# EAGLE design MicromouseV1.0.0 (EAGLE 9.4.2)
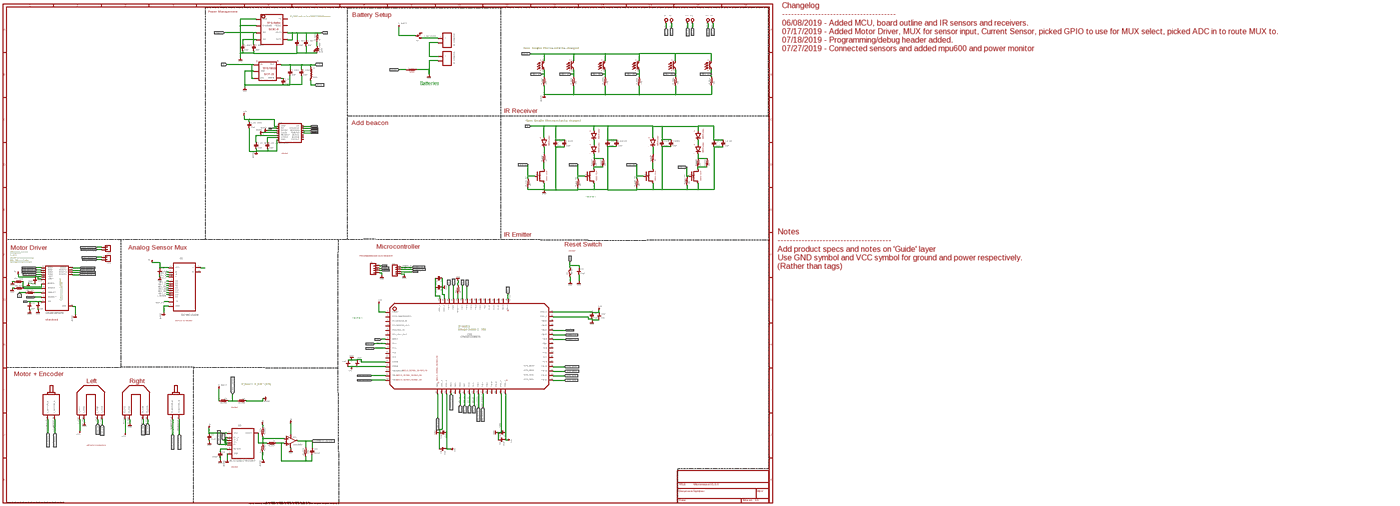
[diagram p0: schematic, sheet 1, overview]
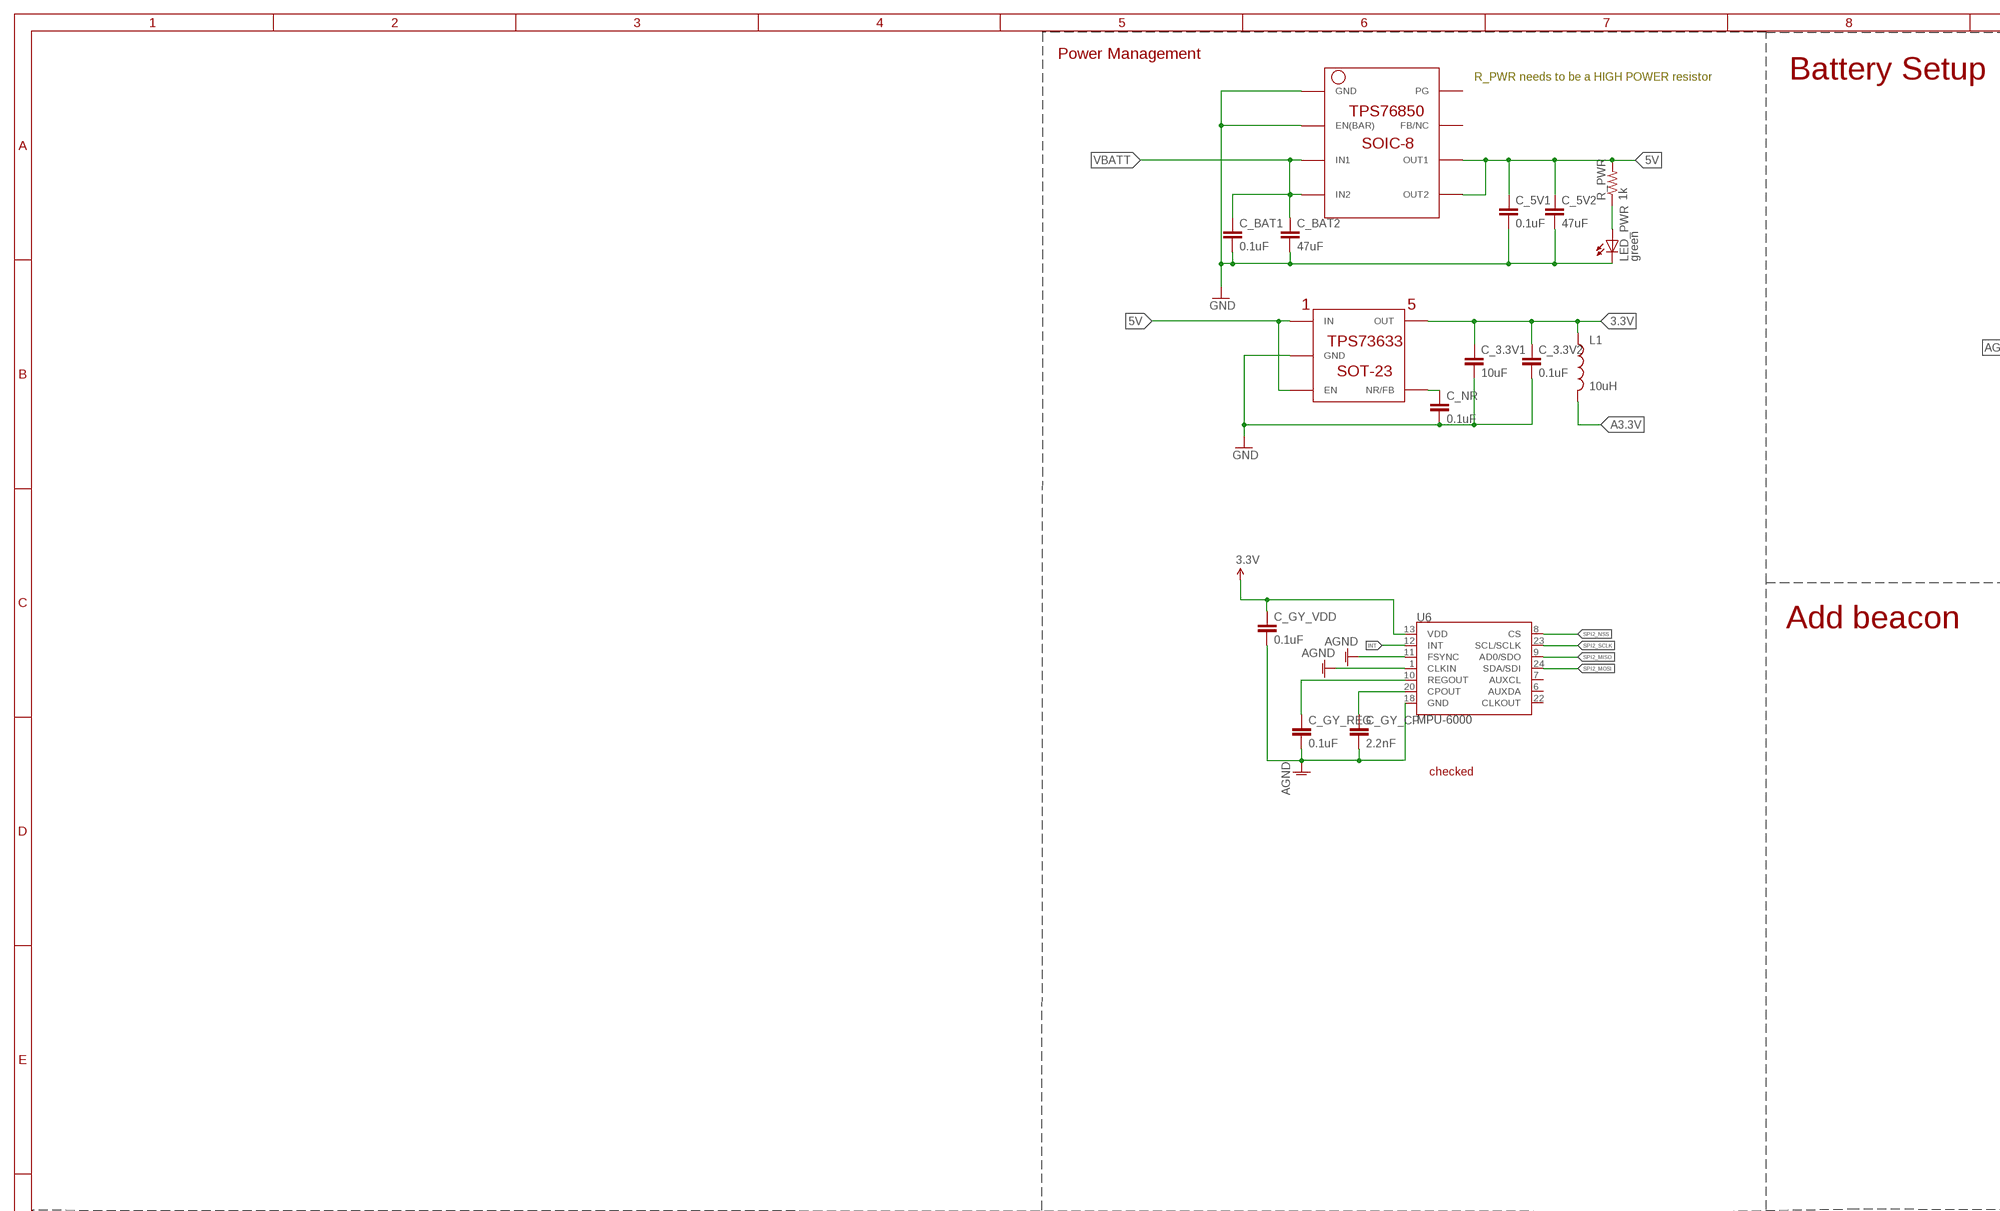
[diagram p1: schematic, sheet 1, part 1 of 6]
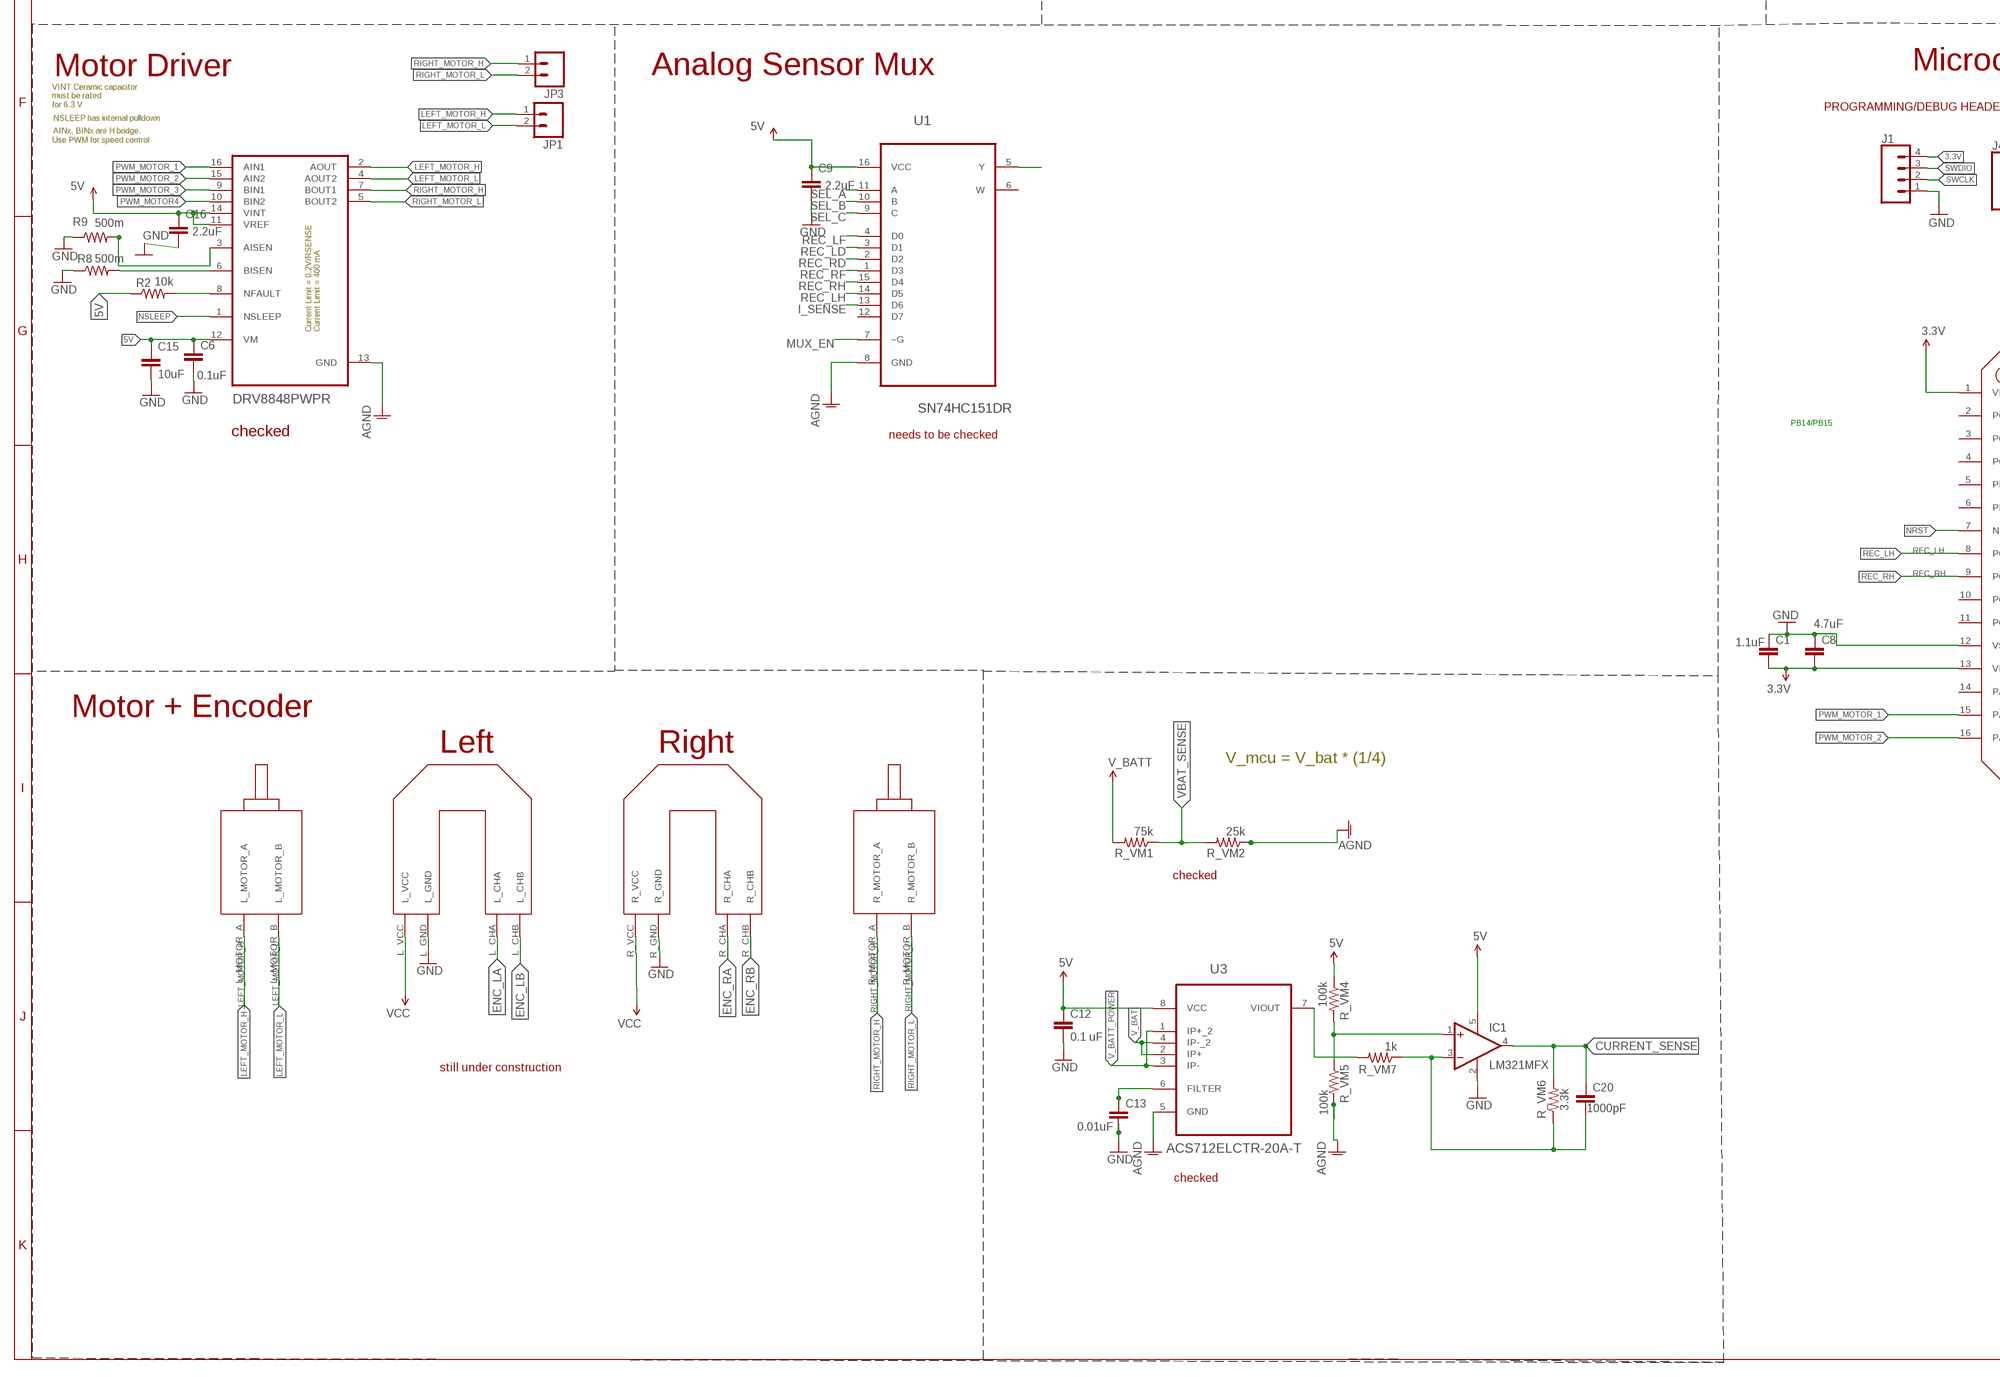
[diagram p2: schematic, sheet 1, part 2 of 6]
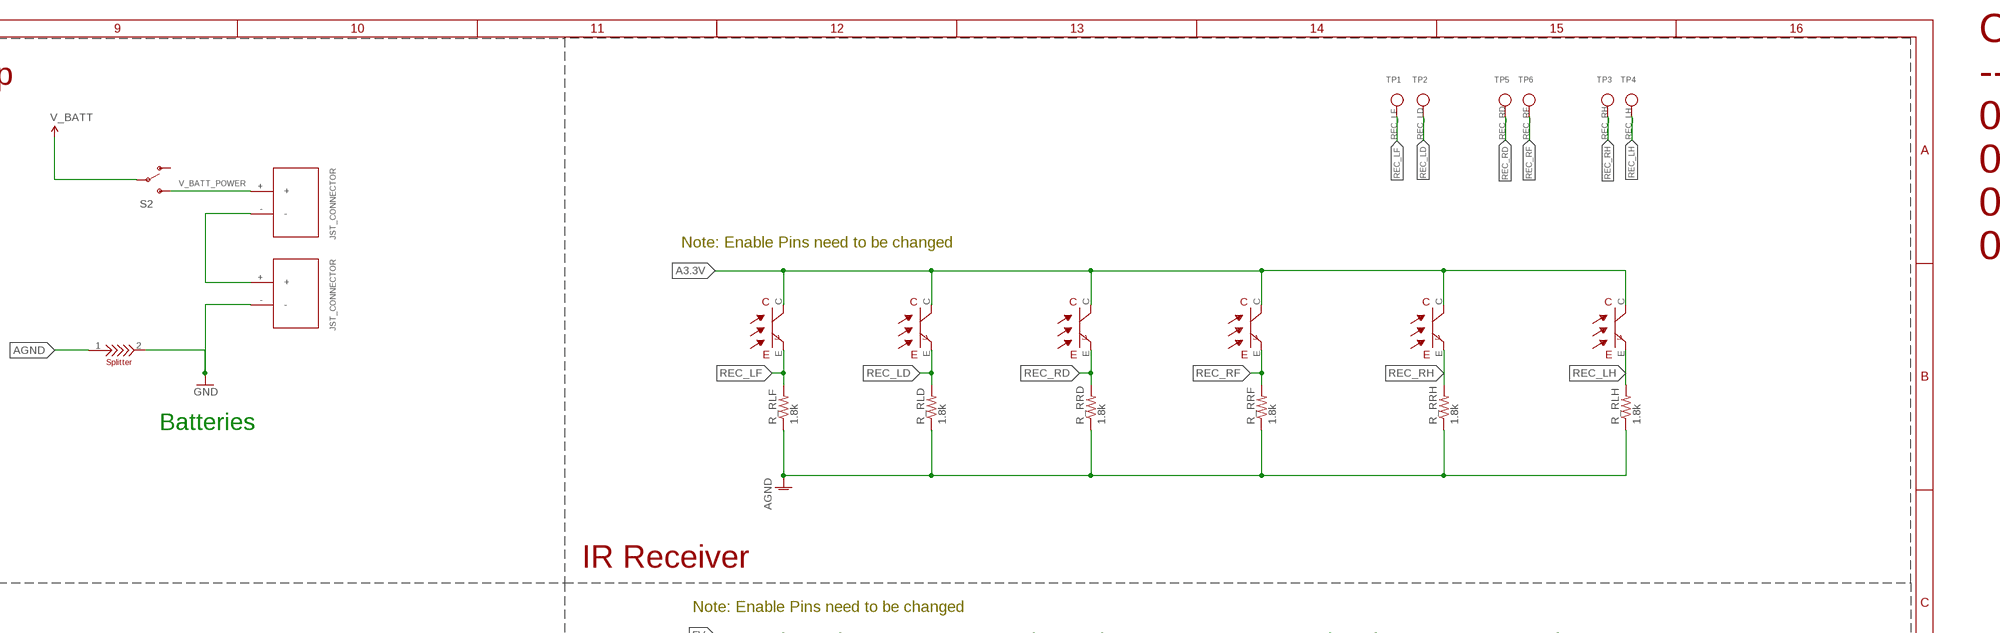
[diagram p3: schematic, sheet 1, part 3 of 6]
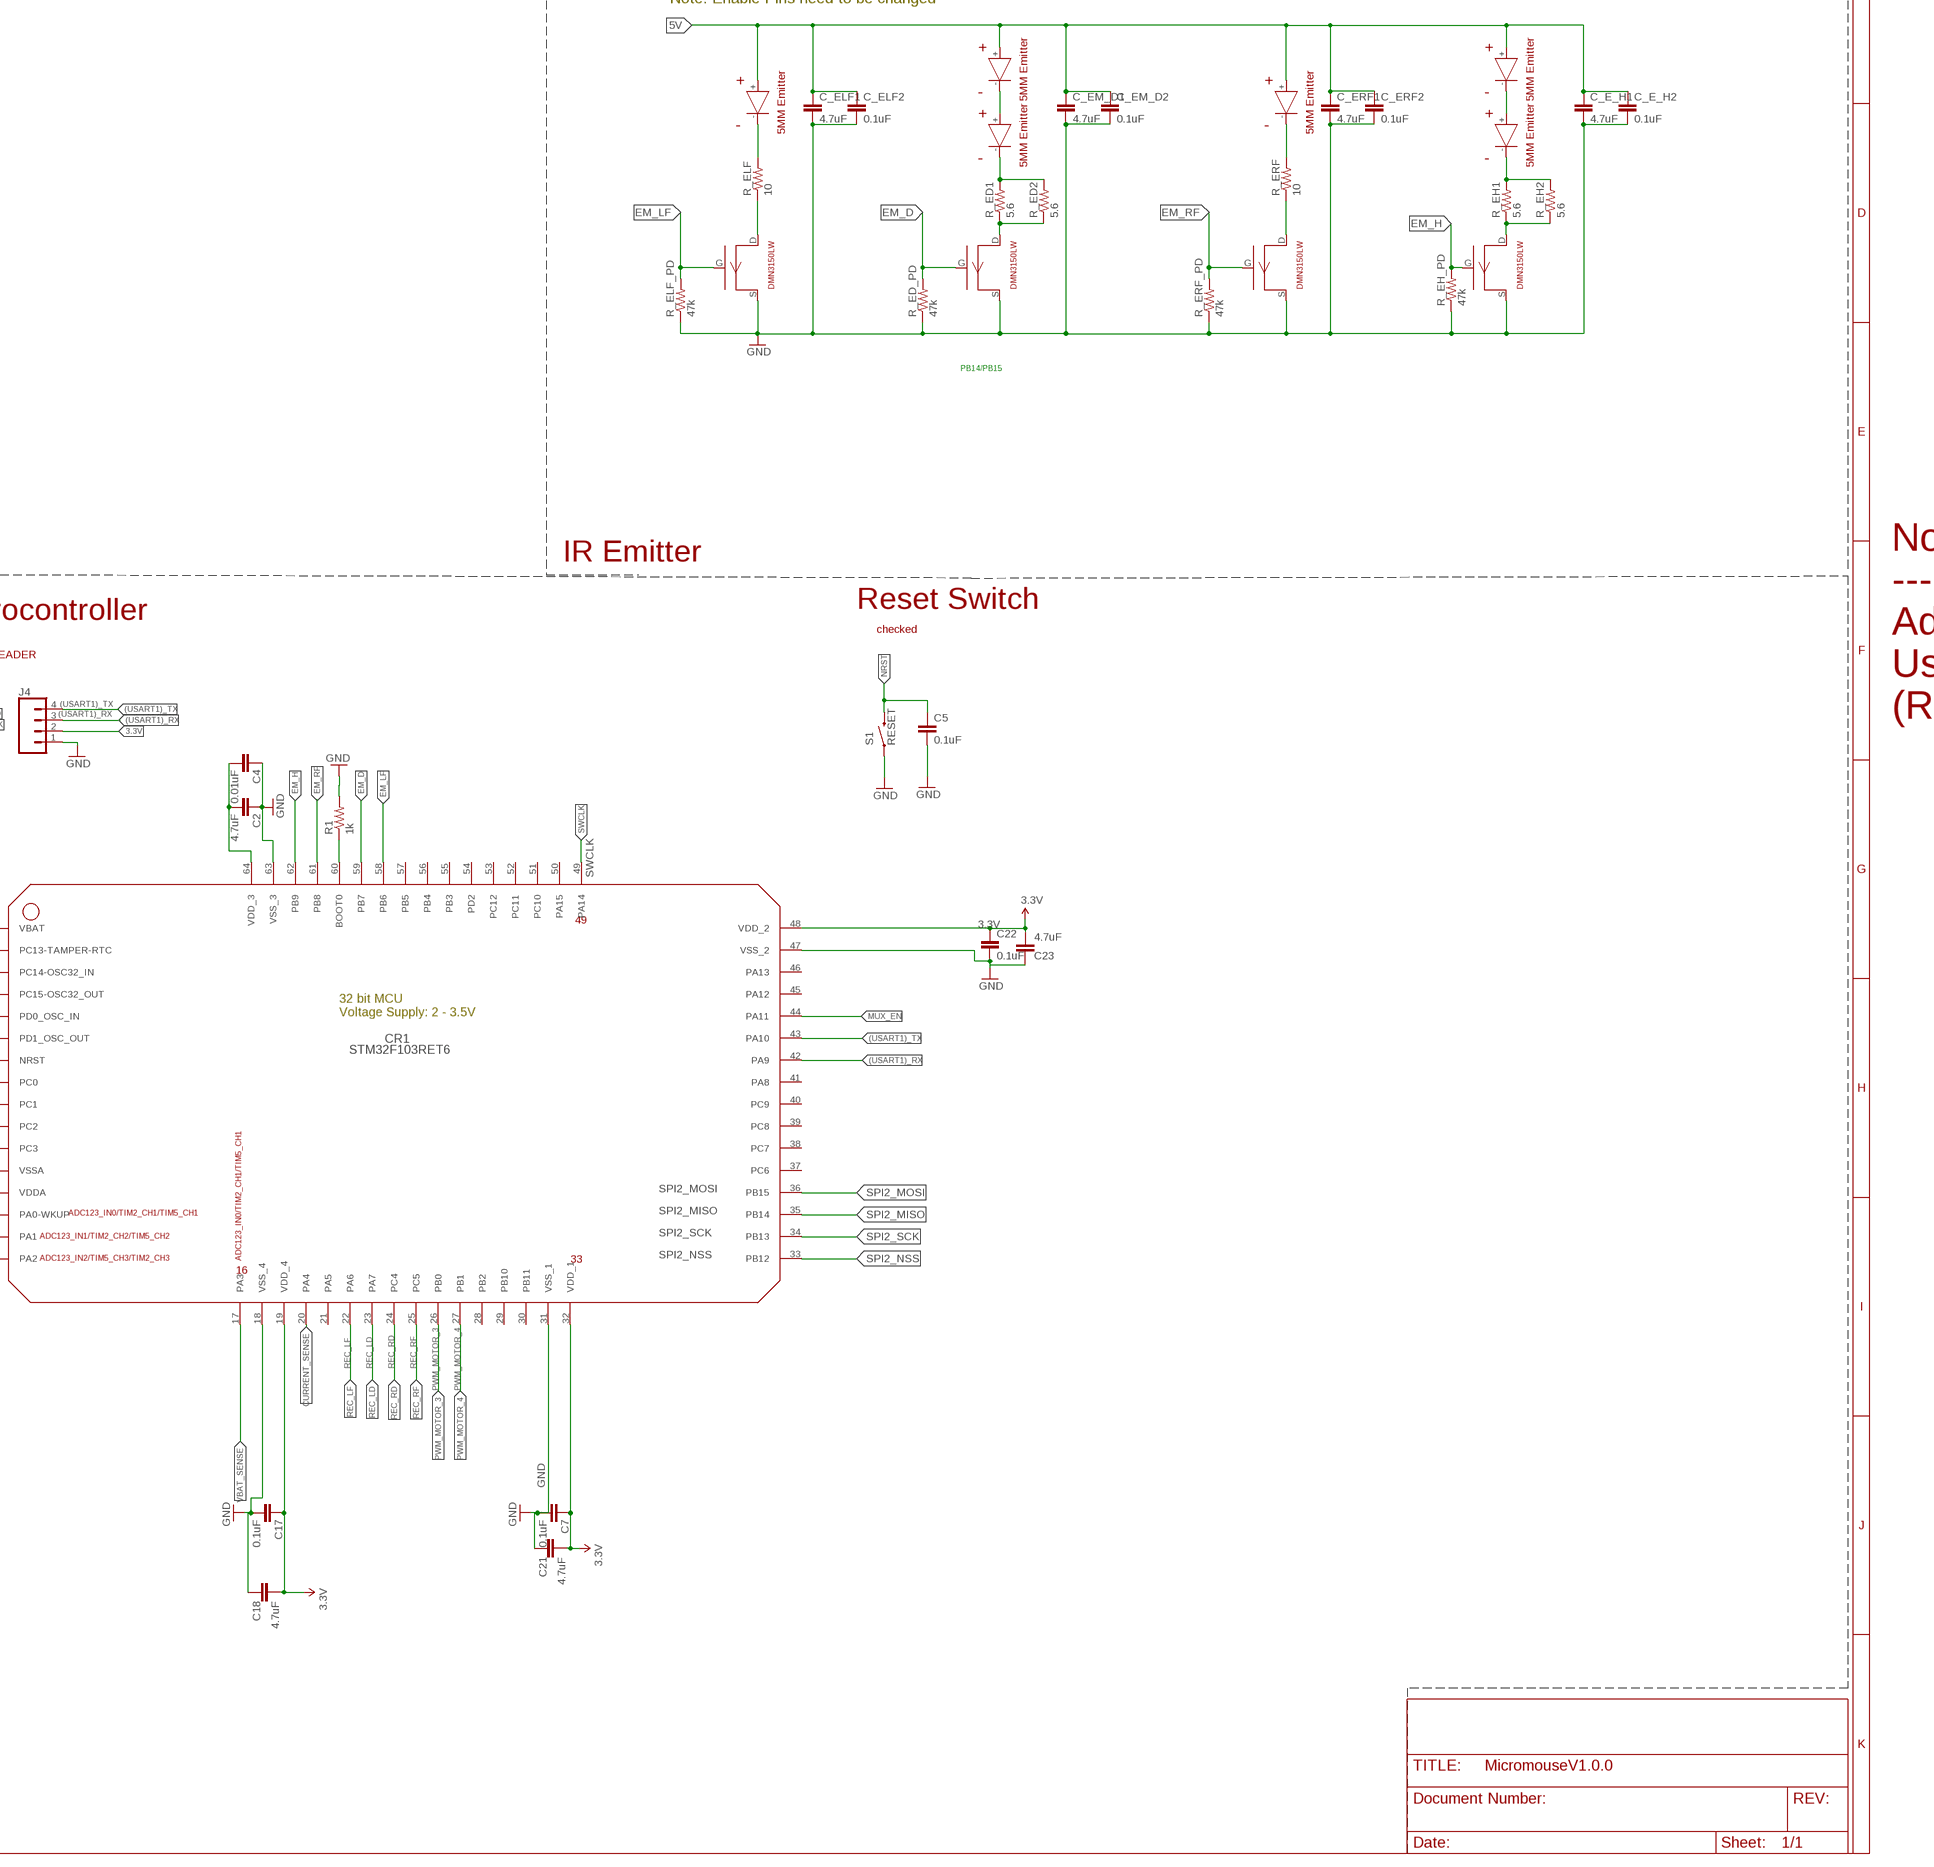
[diagram p4: schematic, sheet 1, part 4 of 6]
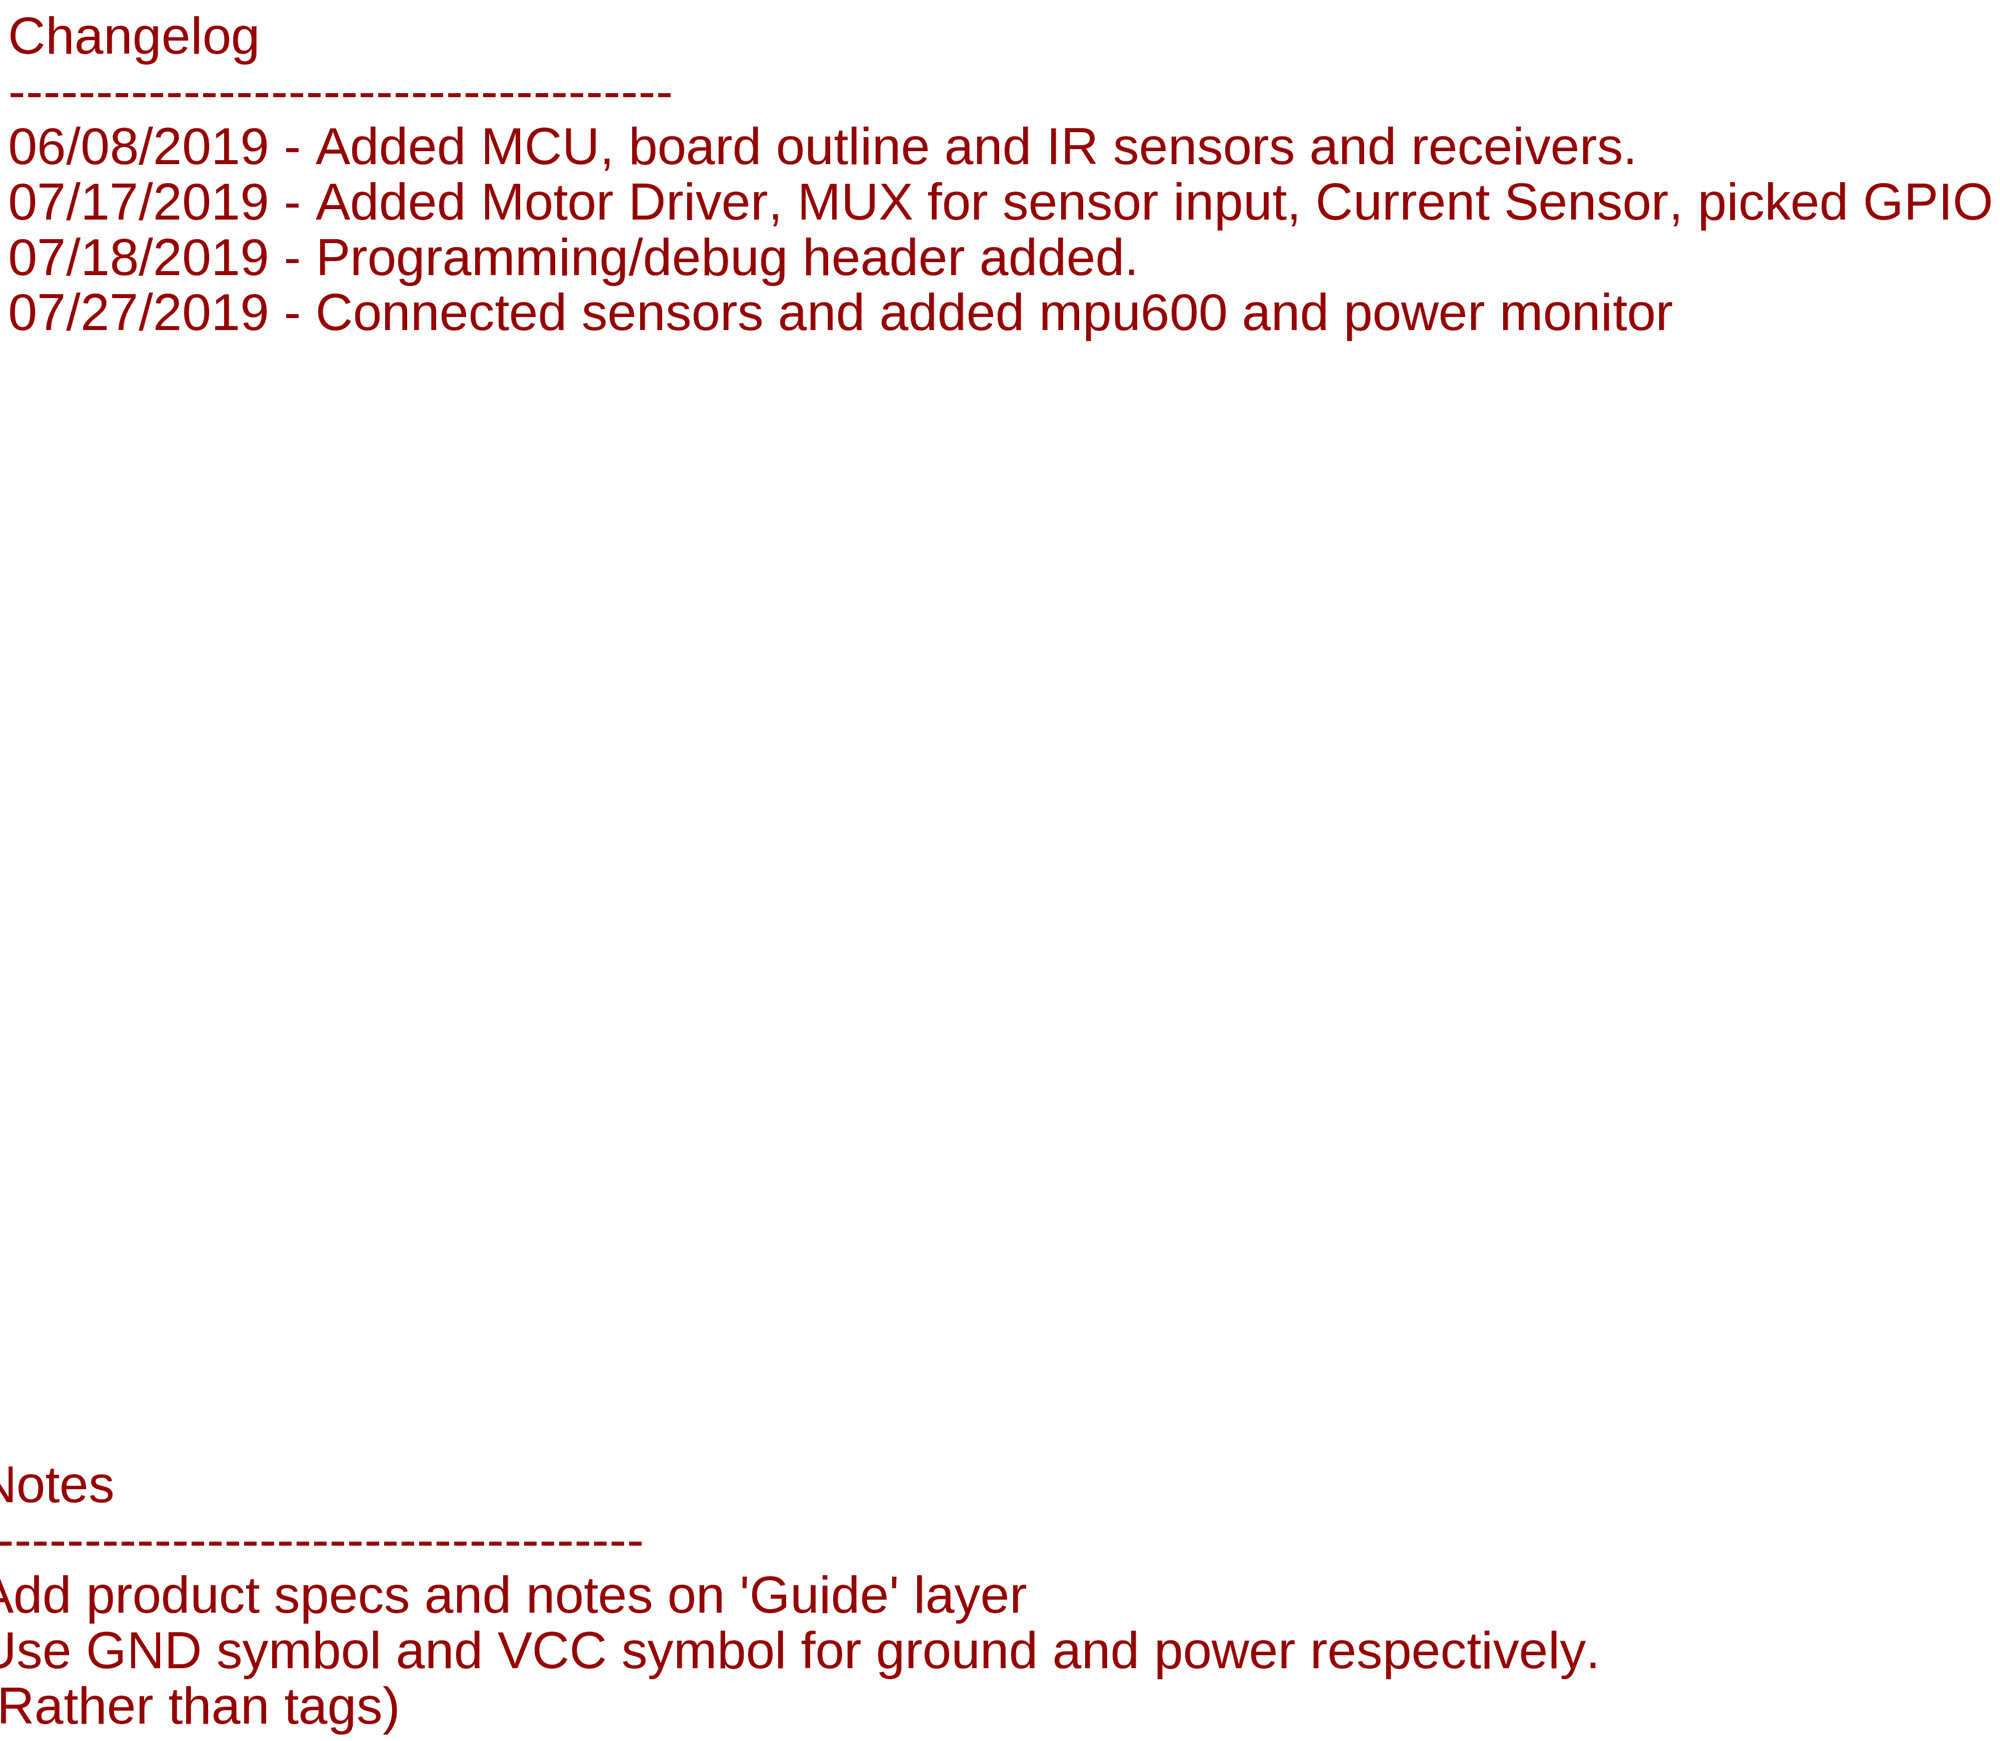
[diagram p5: schematic, sheet 1, part 5 of 6]
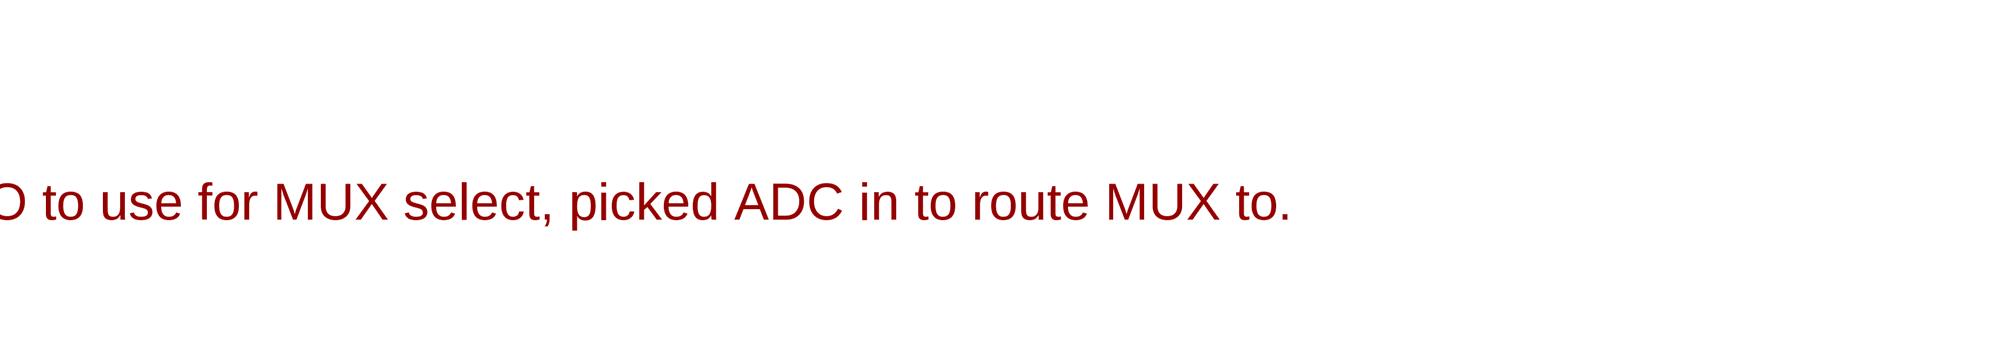
[diagram p6: schematic, sheet 1, part 6 of 6]

## Parts
C1  1.1uF  CAP0603-CAP  [0603-CAP]
C2  4.7uF  CAP0603-CAP  [0603-CAP]
C4  0.01uF  CAP0603-CAP  [0603-CAP]
C5  0.1uF  CAP0603-CAP  [0603-CAP]
C6  0.1uF  CAP0603-CAP  [0603-CAP]
C7  0.1uF  CAP0603-CAP  [0603-CAP]
C8  4.7uF  CAP0603-CAP  [0603-CAP]
C9  2.2uF  CAP0603-CAP  [0603-CAP]
C12  0.1 uF  CAP0603-CAP  [0603-CAP]
C13  0.01uF  CAP0603-CAP  [0603-CAP]
C15  10uF  CAP0603-CAP  [0603-CAP]
C16  2.2uF  CAP0603-CAP  [0603-CAP]
C17  0.1uF  CAP0603-CAP  [0603-CAP]
C18  4.7uF  CAP0603-CAP  [0603-CAP]
C20  1000pF  CAP0603-CAP  [0603-CAP]
C21  4.7uF  CAP0603-CAP  [0603-CAP]
C22  0.1uF  CAP0603-CAP  [0603-CAP]
C23  4.7uF  CAP0603-CAP  [0603-CAP]
C_3.3V1  10uF  CAP0603-CAP  [0603-CAP]
C_3.3V2  0.1uF  CAP0603-CAP  [0603-CAP]
C_5V1  0.1uF  CAP0603-CAP  [0603-CAP]
C_5V2  47uF  CAP1210  [1210]
C_BAT1  0.1uF  CAP0603-CAP  [0603-CAP]
C_BAT2  47uF  CAP1210  [1210]
C_E_H1  4.7uF  CAP0603-CAP  [0603-CAP]
C_E_H2  0.1uF  CAP0603-CAP  [0603-CAP]
C_ELF1  4.7uF  CAP0603-CAP  [0603-CAP]
C_ELF2  0.1uF  CAP0603-CAP  [0603-CAP]
C_EM_D1  4.7uF  CAP0603-CAP  [0603-CAP]
C_EM_D2  0.1uF  CAP0603-CAP  [0603-CAP]
C_ERF1  4.7uF  CAP0603-CAP  [0603-CAP]
C_ERF2  0.1uF  CAP0603-CAP  [0603-CAP]
C_GY_CP  2.2nF  CAP0603-CAP  [0603-CAP]
C_GY_REG  0.1uF  CAP0603-CAP  [0603-CAP]
C_GY_VDD  0.1uF  CAP0603-CAP  [0603-CAP]
C_NR  0.1uF  CAP0603-CAP  [0603-CAP]
CR1  STM32F103RET6  [LQFP-64]
IC1  LM321MFX  [SOT23-5]
J1  CONN_04  [1X04]
J4  CONN_04  [1X04]
JP1  M02POLAR  [MOLEX-1X2]
JP3  M02POLAR  [MOLEX-1X2]
L1  10uH  INDUCTOR1007  [1007]
LED_PWR  green  LED1206  [LED-1206]
LEFT_FRONT_EMITTER  EMITTER  [EMITTER]
NMOS1  DMN3150LW  [DMN3150LW]
NMOS2  DMN3150LW  [DMN3150LW]
NMOS3  DMN3150LW  [DMN3150LW]
NMOS4  DMN3150LW  [DMN3150LW]
R1  1k  R-US_M0805  [M0805]
R2  10k  RESISTOR0805-RES  [0805]
R8  500m  RESISTOR0805-RES  [0805]
R9  500m  RESISTOR0805-RES  [0805]
R_ED1  5.6  RESISTOR0603-RES  [0603-RES]
R_ED2  5.6  RESISTOR0603-RES  [0603-RES]
R_ED_PD  47k  RESISTOR0603-RES  [0603-RES]
R_EH1  5.6  RESISTOR0603-RES  [0603-RES]
R_EH2  5.6  RESISTOR0603-RES  [0603-RES]
R_EH_PD  47k  RESISTOR0603-RES  [0603-RES]
R_ELF  10  RESISTOR0603-RES  [0603-RES]
R_ELF_PD  47k  RESISTOR0603-RES  [0603-RES]
R_ERF  10  RESISTOR0603-RES  [0603-RES]
R_ERF_PD  47k  RESISTOR0603-RES  [0603-RES]
R_PWR  1k  RESISTOR0603-RES  [0603-RES]
R_RLD  1.8k  RESISTOR0603-RES  [0603-RES]
R_RLF  1.8k  RESISTOR0603-RES  [0603-RES]
R_RLH  1.8k  RESISTOR0603-RES  [0603-RES]
R_RRD  1.8k  RESISTOR0603-RES  [0603-RES]
R_RRF  1.8k  RESISTOR0603-RES  [0603-RES]
R_RRH  1.8k  RESISTOR0603-RES  [0603-RES]
R_VM1  75k  RESISTOR0603-RES  [0603-RES]
R_VM2  25k  RESISTOR0603-RES  [0603-RES]
R_VM4  100k  RESISTOR0603-RES  [0603-RES]
R_VM5  100k  RESISTOR0603-RES  [0603-RES]
R_VM6  3.3k  RESISTOR0603-RES  [0603-RES]
R_VM7  1k  RESISTOR0603-RES  [0603-RES]
REC_LF  RECEIVER  [RECEIVER]
S1  RESET  SWITCH-MOMENTARY-2SMD-4.6X2.8MM  [TACTILE_SWITCH_SMD_4.6X2.8MM]
S2  SWITCH-SPSTPTH  [SWITCH-SPDT]
TP1  TESTPOINTROUND2MM  [TESTPOINT_ROUND_2MM]
TP2  TESTPOINTROUND2MM  [TESTPOINT_ROUND_2MM]
TP3  TESTPOINTROUND2MM  [TESTPOINT_ROUND_2MM]
TP4  TESTPOINTROUND2MM  [TESTPOINT_ROUND_2MM]
TP5  TESTPOINTROUND2MM  [TESTPOINT_ROUND_2MM]
TP6  TESTPOINTROUND2MM  [TESTPOINT_ROUND_2MM]
U1  SN74HC151DR  [SOIC127P600X175-16N]
U2  DRV8848PWPR  [SOP65P640X120-17N]
U3  ACS712ELCTR-20A-T  [SOIC127P600X175-8N]
U6  MPU-6000  [QFN-24-EP]
U$1  JST_CONNECTOR_FEMALE  [JST_CONNECTOR_FEMALE]
U$2  JST_CONNECTOR_FEMALE  [JST_CONNECTOR_FEMALE]
U$3  TPS73633(SOT-23)  [TPS73633(SOT-23)]
U$4  TPS76850(SOIC-8)  [TPS76850(SOIC-8)]
U$7  RECEIVER  [RECEIVER]
U$8  RECEIVER  [RECEIVER]
U$9  RECEIVER  [RECEIVER]
U$11  EMITTER  [EMITTER]
U$12  MY_MM_MOTOR_MOUNT  [MY_MM_MOTOR_MOUNT]
U$13  EMITTER  [EMITTER]
U$16  SPLITTER  [SPLITTER]
U$17  EMITTER  [EMITTER]
U$18  EMITTER  [EMITTER]
U$19  EMITTER  [EMITTER]
U$20  RECEIVER  [RECEIVER]
U$21  RECEIVER  [RECEIVER]

## Nets
3.3V: C7.1 C17.1 C18.2 C21.2 C22.1 C23.2 C_3.3V1.1 C_3.3V2.1 C_GY_VDD.1 CR1.1(VBAT) CR1.19(VDD_4) CR1.32(VDD_1) CR1.48(VDD_2) J1.4 J4.2 L1.1 U6.13(VDD) U$3.OUT
5V: C6.1 C9.1 C12.1 C15.1 C16.1 C_5V1.1 C_5V2.1 C_E_H1.1 C_E_H2.1 C_ELF1.1 C_ELF2.1 C_EM_D1.1 C_EM_D2.1 C_ERF1.1 C_ERF2.1 LEFT_FRONT_EMITTER.+ R2.1 R_PWR.2 U1.16(VCC) U2.11(VREF) U2.12(VM) U2.14(VINT) U3.8(VCC) U$3.EN U$3.IN U$4.OUT1 U$4.OUT2 U$11.+ U$13.+ U$18.+
(USART1)_RX: CR1.42(PA9) J4.3
(USART1)_TX: CR1.43(PA10) J4.4
A3.3V: L1.2 REC_LF.C U$7.C U$8.C U$9.C U$20.C U$21.C
AGND: C_GY_CP.2 C_GY_REG.2 C_GY_VDD.2 R_RLD.1 R_RLF.1 R_RLH.1 R_RRD.1 R_RRF.1 R_RRH.1 R_VM2.1 R_VM5.2 U1.8(GND) U2.13(GND) U3.5(GND) U6.1(CLKIN) U6.11(FSYNC) U6.18(GND) U$16.1
CURRENT_SENSE: C20.1 CR1.20(PA4) IC1.4(OUT) R_VM6.2
D2_EM: R_ED1.2 R_ED2.2 U$17.-
D_EM: U$11.- U$17.+
EM_D: CR1.59(PB7) NMOS2.G R_ED_PD.2
EM_H: CR1.62(PB9) NMOS4.G R_EH_PD.2
EM_LF: CR1.58(PB6) NMOS1.G R_ELF_PD.2
EM_RF: CR1.61(PB8) NMOS3.G R_ERF_PD.2
ENC_LA: U$12.L_CHA
ENC_LB: U$12.L_CHB
ENC_RA: U$12.R_CHA
ENC_RB: U$12.R_CHB
GND: C1.1 C2.1 C4.1 C5.2 C6.2 C7.2 C8.1 C9.2 C12.2 C13.2 C15.2 C16.2 C17.2 C18.1 C21.1 C22.2 C23.1 C_3.3V1.2 C_3.3V2.2 C_5V1.2 C_5V2.2 C_BAT1.2 C_BAT2.2 C_E_H1.2 C_E_H2.2 C_ELF1.2 C_ELF2.2 C_EM_D1.2 C_EM_D2.2 C_ERF1.2 C_ERF2.2 C_NR.2 CR1.12(VSSA) CR1.18(VSS_4) CR1.31(VSS_1) CR1.47(VSS_2) CR1.63(VSS_3) IC1.2(V-) J1.1 J4.1 LED_PWR.C NMOS1.S NMOS2.S NMOS3.S NMOS4.S R1.2 R8.1 R9.1 R_ED_PD.1 R_EH_PD.1 R_ELF_PD.1 R_ERF_PD.1 S1.1 S1.2 U$1.- U$3.GND U$4.EN(BAR) U$4.GND U$12.L_GND U$12.R_GND U$16.2
H2_EM: R_EH1.2 R_EH2.2 U$19.-
H_EM: U$18.- U$19.+
I_SENSE: U1.13(D6)
INT: U6.12(INT)
LEFT_MOTOR_H: JP1.1 U2.2(AOUT) U$12.L_MOTOR_A
LEFT_MOTOR_L: JP1.2 U2.4(AOUT2) U$12.L_MOTOR_B
LF_EM: LEFT_FRONT_EMITTER.- R_ELF.2
MUX_EN: CR1.44(PA11) U1.7(~G)
N$1: C13.1 U3.6(FILTER)
N$2: U1.5(Y)
N$5: NMOS3.D R_ERF.1
N$7: NMOS1.D R_ELF.1
N$9: CR1.60(BOOT0) R1.1
N$11: U$1.+ U$2.-
N$12: R2.2 U2.8(NFAULT)
N$15: R9.2 U2.3(AISEN)
N$18: NMOS2.D R_ED1.1 R_ED2.1
N$19: NMOS4.D R_EH1.1 R_EH2.1
N$20: R8.2 U2.6(BISEN)
N$21: IC1.1(+IN) R_VM4.2 R_VM5.1
N$24: R_VM7.2 U3.7(VIOUT)
N$25: C2.2 C4.2 CR1.64(VDD_3)
N$26: C_NR.1 U$3.NR/FB
N$27: LED_PWR.A R_PWR.1
N$28: C_GY_REG.1 U6.10(REGOUT)
N$29: C_GY_CP.1 U6.20(CPOUT)
N$31: C20.2 IC1.3(-IN) R_VM6.1 R_VM7.1
NRST: C5.1 CR1.7(NRST) S1.3 S1.4
NSLEEP: U2.1(NSLEEP)
PWM_MOTOR4: U2.10(BIN2)
PWM_MOTOR_1: CR1.15(PA1) U2.16(AIN1)
PWM_MOTOR_2: CR1.16(PA2) U2.15(AIN2)
PWM_MOTOR_3: CR1.26(PB0) U2.9(BIN1)
PWM_MOTOR_4: CR1.27(PB1)
REC_LD: CR1.23(PA7) R_RLD.2 TP2.P$1 U1.3(D1) U$7.E
REC_LF: CR1.22(PA6) R_RLF.2 REC_LF.E TP1.P$1 U1.4(D0)
REC_LH: CR1.8(PC0) R_RLH.2 TP4.P$1 U1.14(D5) U$21.E
REC_RD: CR1.24(PC4) R_RRD.2 TP5.P$1 U1.2(D2) U$8.E
REC_RF: CR1.25(PC5) R_RRF.2 TP6.P$1 U1.1(D3) U$9.E
REC_RH: CR1.9(PC1) R_RRH.2 TP3.P$1 U1.15(D4) U$20.E
RF_EM: R_ERF.2 U$13.-
RIGHT_MOTOR_H: JP3.1 U2.7(BOUT1) U$12.R_MOTOR_A
RIGHT_MOTOR_L: JP3.2 U2.5(BOUT2) U$12.R_MOTOR_B
SEL_A: U1.11(A)
SEL_B: U1.10(B)
SEL_C: U1.9(C)
SPI2_MISO: CR1.35(PB14) U6.9(AD0/SDO)
SPI2_MOSI: CR1.36(PB15) U6.24(SDA/SDI)
SPI2_NSS: CR1.33(PB12) U6.8(CS)
SPI2_SCK: CR1.34(PB13)
SPI2_SCLK: U6.23(SCL/SCLK)
SWCLK: CR1.49(PA14) J1.2
SWDIO: J1.3
V_BAT: U3.2(IP+) U3.4(IP-_2)
V_BATT: IC1.5(V+) R_VM1.2 R_VM4.1 S2.2(P) ; supply symbol labelled 5V
V_BATT_POWER: S2.3(S) U3.1(IP+_2) U3.3(IP-) U$2.+
VBAT_SENSE: CR1.17(PA3) R_VM1.1 R_VM2.2
VBATT: C_BAT1.1 C_BAT2.1 U$4.IN1 U$4.IN2
VCC: C1.2 C8.2 CR1.13(VDDA) U$12.L_VCC U$12.R_VCC ; supply symbol labelled 3.3V
Unconnected: CR1.2(PC13-TAMPER-RTC) CR1.3(PC14-OSC32_IN) CR1.4(PC15-OSC32_OUT) CR1.5(PD0_OSC_IN) CR1.6(PD1_OSC_OUT) CR1.10(PC2) CR1.11(PC3) CR1.14(PA0-WKUP) CR1.21(PA5) CR1.28(PB2) CR1.29(PB10) CR1.30(PB11) CR1.37(PC6) CR1.38(PC7) CR1.39(PC8) CR1.40(PC9) CR1.41(PA8) CR1.45(PA12) CR1.46(PA13) CR1.50(PA15) CR1.51(PC10) CR1.52(PC11) CR1.53(PC12) CR1.54(PD2) CR1.55(PB3) CR1.56(PB4) CR1.57(PB5) S2.1(O) U1.6(W) U1.12(D7) U6.6(AUXDA) U6.7(AUXCL) U6.22(CLKOUT) U$4.FB/NC U$4.PG

## Notes on the sheet
- Power Management
- R_PWR needs to be a HIGH POWER resistor | Battery Setup
- Note: Enable Pins need to be changed
- Changelog
  --------------------------------------
  06/08/2019 - Added MCU, board outline and IR sensors and receivers.                                      
  07/17/2019 - Added Motor Driver, MUX for sensor input, Current Sensor, picked GPIO to use for MUX select, picked ADC in to route MUX to. 
  07/18/2019 - Programming/debug header added.
  07/27/2019 - Connected sensors and added mpu600 and power monitor
- Batteries
- IR Receiver
- Note: Enable Pins need to be changed
- Add beacon
- checked
- PB14/PB15
- IR Emitter
- Reset Switch
- Motor Driver | Analog Sensor Mux | Microcontroller
- checked
- VINT Ceramic capacitor 
  must be rated 
  for 6.3 V
- PROGRAMMING/DEBUG HEADER
- NSLEEP has internal pulldown
- AINx, BINx are H bridge.
- Use PWM for speed control
- Notes
  --------------------------------------
  Add product specs and notes on 'Guide' layer
  Use GND symbol and VCC symbol for ground and power respectively.
  (Rather than tags)
- Current Limit = 0.2V/RSENSE
  Current Limit = 400 mA
- PB14/PB15
- checked | needs to be checked
- 32 bit MCU
  Voltage Supply: 2 - 3.5V
- ADC123_IN0/TIM2_CH1/TIM5_CH1
- Motor + Encoder | ADC123_IN1/TIM2_CH2/TIM5_CH2
- ADC123_IN2/TIM5_CH3/TIM2_CH3 | ADC123_IN0/TIM2_CH1/TIM5_CH1
- V_mcu = V_bat * (1/4)
- checked
- still under construction
- checked

## Library data of the parts
C1 C2 C4-C9 C12 C13 C15-C18 C20-C23 C_E_H1 C_E_H2 C_ELF1 C_ELF2 C_EM_D1 C_EM_D2 C_ERF1 C_ERF2 = MicromouseV0.0.4:CAP: Capacitor Standard 0603 ceramic capacitor, and 0.1" leaded capacitor.
C_3.3V1 C_3.3V2 C_5V1 C_5V2 C_BAT2 C_GY_CP C_GY_REG C_GY_VDD C_NR = SparkFun:CAP: Capacitor Standard 0603 ceramic capacitor, and 0.1" leaded capacitor.
C_BAT1 = SparkFun-Capacitors:CAP: Capacitor Standard 0603 ceramic capacitor, and 0.1" leaded capacitor.
CR1 = MicromouseV0.0.4:STM32F103RET6; MANUFACTURER_PART_NUMBER: STM32F103RET6; VENDOR: STMicroelectronics
IC1 = linear:LM321?*: Low Power Single Op Amp Source: http://cache.national.com/ds/LM/LM321.pdf
J1 J4 = MicromouseV0.0.4:CONN_04: Multi connection point. Often used as Generic Header-pin footprint for 0.1 inch spaced/style header connections On any of the 0.1 inch spaced packages, you can populate with these: Break Away Headers - Straight <https://www.sparkfun.com/products/116> (PRT-00116) Break Away Male Headers - Right Angle <https://www.sparkfun.com/products/553> (PRT-00553) Female Headers <https://www.sparkfun.com/products/115> (PRT-00115) Break Away Headers - Machine Pin <https://www.sparkfun.com/products/117> (PRT-00117) Break Away Female Headers - Swiss Machine Pin <https://www.sparkfun.com/products/743> (PRT-00743) For SCREWTERMINALS and SPRING TERMINALS visit here: Screw Terimnals on SparkFun.com <https://www.sparkfun.com/search/results?term=Screw+Terminals> (5mm/3.5mm/2.54mm spacing) This device is also useful as a general connection point to wire up your design to another part of your project. Our various solder wires solder well into these plated through hole pads. Hook-Up Wire - Assortment (Stranded, 22 AWG) <https://www.sparkfun.com/products/11375> (PRT-11375) Hook-Up Wire - Assortment (Solid Core, 22 AWG) <https://www.sparkfun.com/products/11367> (PRT-11367) View the entire wire category on our website here <https://www.sparkfun.com/categories/141> Special notes: Molex polarized connector foot print use with SKU : PRT-08231 with associated crimp pins and housings. 1MM SMD Version SKU: PRT-10208; PROD_ID: CONN-09696
JP1 JP3 = EGSE_SIMv0.0.3:M02: Header 2 Standard 2-pin 0.1" header. Use with straight break away headers (SKU : PRT-00116), right angle break away headers (PRT-00553), swiss pins (PRT-00743), machine pins (PRT-00117), and female headers (PRT-00115). Molex polarized connector foot print use with SKU : PRT-08233 with associated crimp pins and housings.
L1 = SparkFun-Passives:INDUCTOR: Inductors Basic Inductor/Choke - 0603 and 1206. Footprints are not proven and vary greatly between part numbers. INDUCTOR POWER 3.3UH 4.0A SMD 0.197" L x 0.197" W x 0.177" H (5.00mm x 5.00mm x 4.50mm)
LED_PWR = SparkFun:LED: LEDs Standard schematic elements and footprints for 5mm, 3mm, 1206, and 0603 sized LEDs. 5mm - Spark Fun Electronics SKU : COM-00529 (and others)
LEFT_FRONT_EMITTER U$11 U$13 U$17-U$19 = MicromouseV0.0.4:EMITTER
NMOS1-NMOS4 = MicromouseV0.0.4:DMN3150LW
R1 = rcl:R-US_: RESISTOR, American symbol; SPICEPREFIX: R
R2 R8 R9 R_ED1 R_ED2 R_ED_PD R_EH1 R_EH2 R_EH_PD R_ELF R_ELF_PD R_ERF R_ERF_PD R_RLD R_RLF R_RLH R_RRD R_RRF R_RRH = MicromouseV0.0.4:RESISTOR: Resistor Basic schematic elements and footprints for 0603, 1206, and PTH resistors.
R_PWR R_VM1 R_VM2 R_VM4-R_VM7 = SparkFun-Passives:RESISTOR: Resistor Basic schematic elements and footprints for 0603, 1206, and PTH resistors.
REC_LF U$7-U$9 U$20 U$21 = MicromouseV0.0.4:RECEIVER
S1 = SparkFun-Electromechanical:SWITCH-MOMENTARY-2: Various NO switches- pushbuttons, reed, etc; PROD_ID: SWCH-13065
S2 = SparkFun:SWITCH-SPST: SPST Switch Simple slide switch. Spark Fun Electronics SKU : COM-00102
TP1-TP6 = microbuilder:TESTPOINT: Test Point Various test points for characterisation and PCB testing TESTPOINT_SMT - Compact Surface Mount Test Point [Digikey: 5016KTR-ND]
U1 = MicromouseV0.0.4:SN74HC151DR: 8-Line to 1-Line Dataselectors /MultiPlexers; AVAILABILITY: Unavailable; DESCRIPTION: 8-Line To 1-Line Data Selectors/Multiplexers 16-SOIC -40 to 85; MF: Texas Instruments; MP: SN74HC151DR; PACKAGE: SOIC-16 Texas Instruments; PRICE: None
U2 = MicromouseV0.0.4:DRV8848PWPR: None; AVAILABILITY: Unavailable; DESCRIPTION: 2A Dual H-Bridge Motor Driver _PWM Control_ 16-HTSSOP -40 to 85; MF: Texas Instruments; MP: DRV8848PWPR; PACKAGE: HTSSOP-16 Texas Instruments; PRICE: None
U3 = MicromouseV0.0.4:ACS712ELCTR-20A-T: Linear Current Sensor; AVAILABILITY: Unavailable; DESCRIPTION: Fully Integrated, Hall Effect-Based Linear Current Sensor IC with 2.1 kVRMS Voltage Isolation and a Low-Resistance Cu...; MF: Allegro; MP: ACS712ELCTR-20A-T; PACKAGE: SOIC-8 Allegro MicroSystems LLC; PRICE: None
U6 = SparkFun-Sensors:MPU-6000: Invensense MPU-6000 6-Axis Gryoscope/Accelerometer 3-axis gyroscope, 3-axis accelerometer in a 4x4 package. The MPU-6000 is the world’s first 6-axis I²C MotionTracking device designed for the low power, low cost, and high performance requirements of smartphones, tablets and wearable sensors. Datasheet <http://cdn.sparkfun.com/datasheets/Components/General%20IC/PS-MPU-6000A.pdf> SparkFun Products MPU-6000 - Motion Processing Unit <https://www.sparkfun.com/products/11234> (SEN-11234) SparkFun UDB5 - PIC UAV Development Board <https://www.sparkfun.com/products/11703> (GPS-11703); PROD_ID: IC-11089; SF_ID: SEN-11234
U$1 U$2 = JST_CONNECTOR_FEMALE. through hole:JST_CONNECTOR_FEMALE
U$3 = TPS73633(SOT-23):TPS73633(SOT-23)
U$4 = TPS76850(SOIC-8):TPS76850(SOIC-8)
U$12 = MicromouseV0.0.4:MY_MM_MOTOR_MOUNT
U$16 = splitter:SPLITTER

## Board
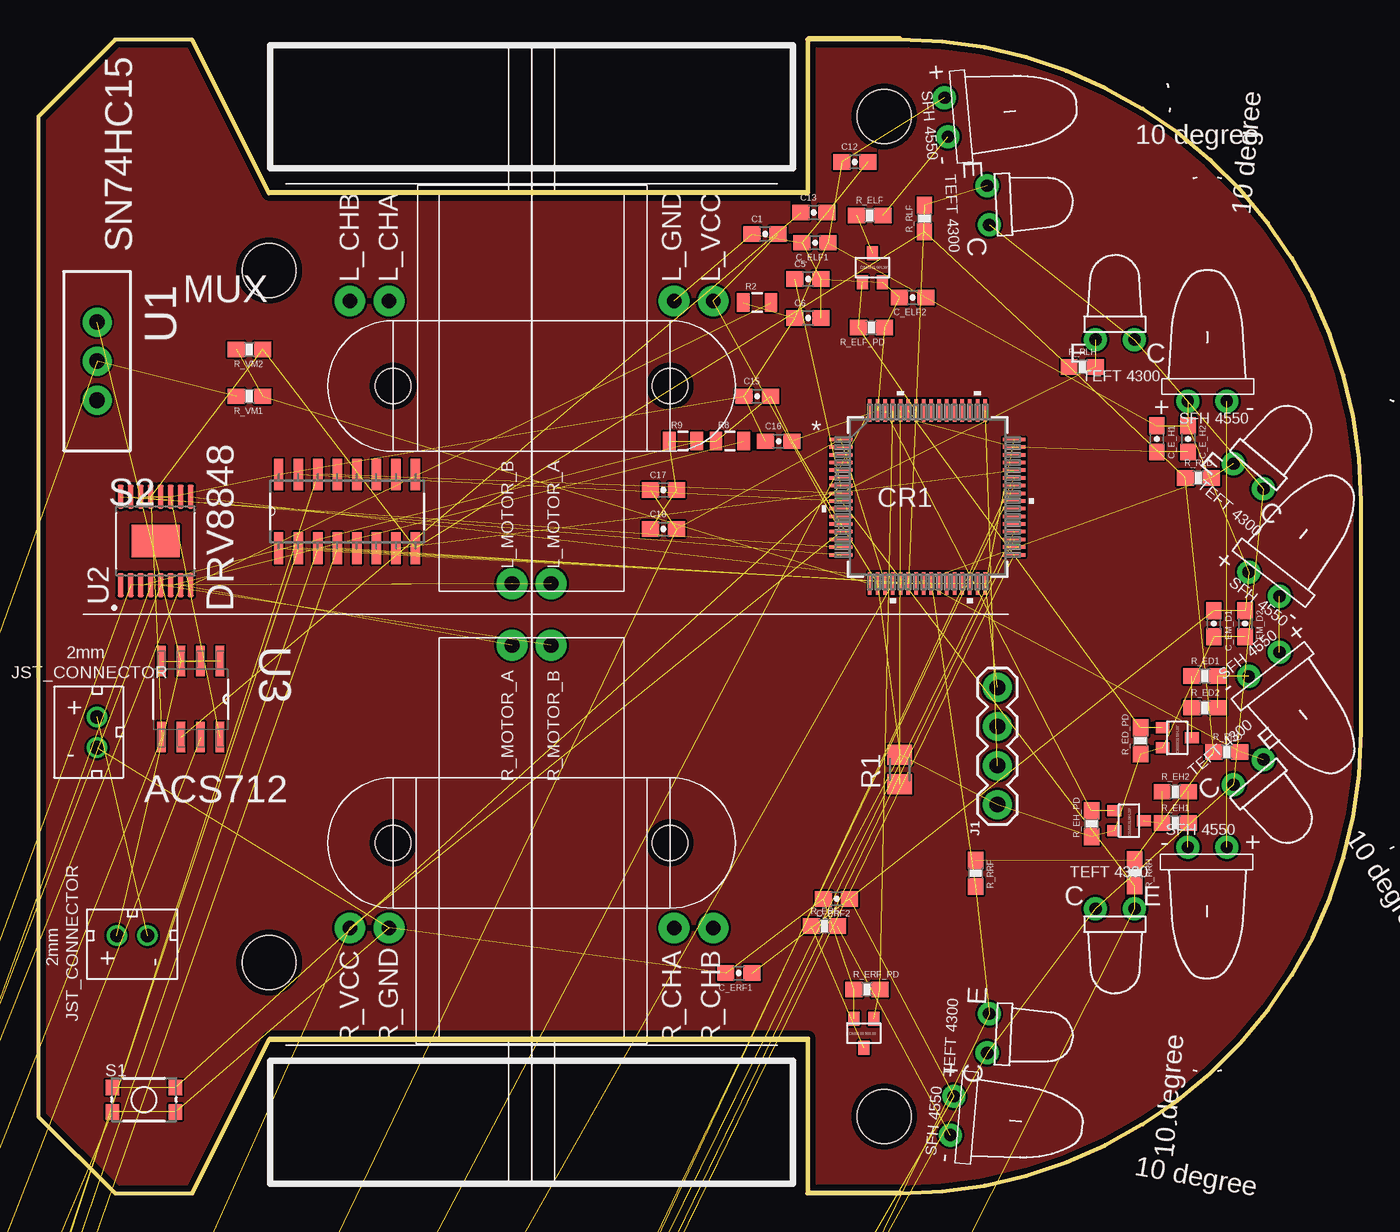
[diagram p7: board, top side]
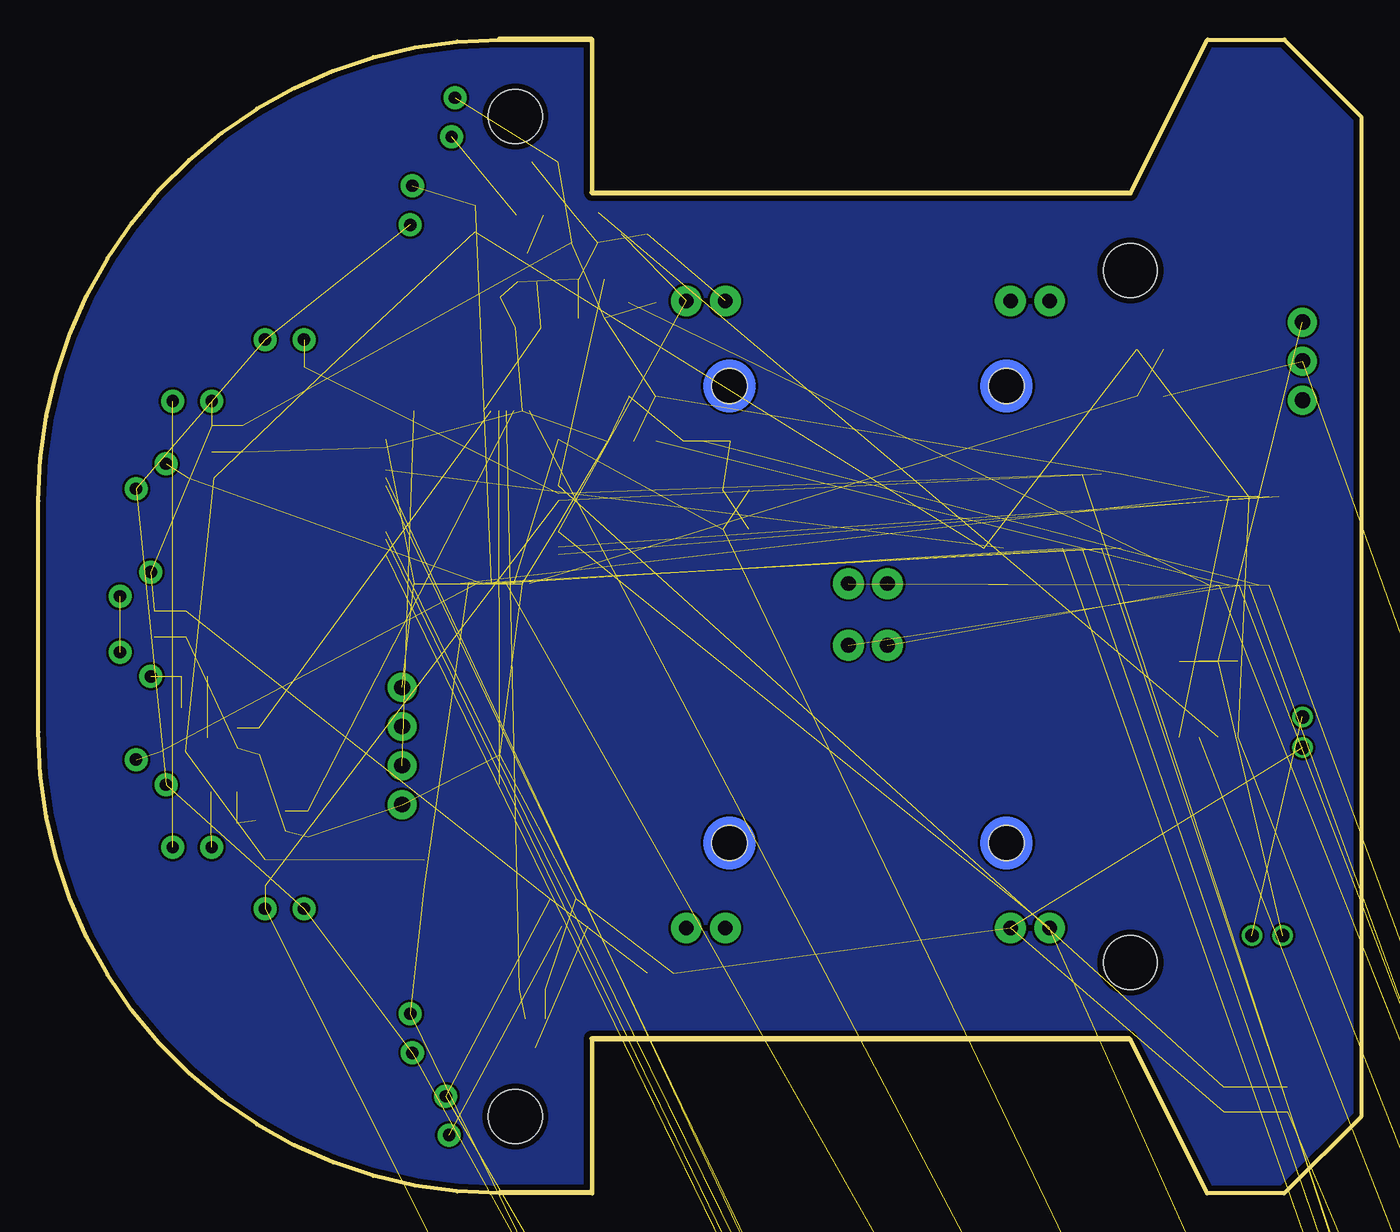
[diagram p8: board, bottom side, seen from below]

Size 86 x 75 mm. Coordinates in mm from the lower left corner, seen from the top.
Outline: 50,10 50,0 56,0 arc90 86,30 86,45 arc90 56,75 50,75 50,65 15,65 9.99,75 4.98,75 0,70 0,5 5,0 10,0 15,10 50,10
Copper layers (1*16): Top 0.0356mm / dielectric 1.5011mm / Bottom 0.0356mm
Design rules "LaenPCBOrder": minimum track width 6mil, minimum drill 13mil, track to track 6mil, track to pad 6mil, pad to pad 6mil, via to via 6mil, smd to smd 6mil, copper to edge 15mil, drill to drill 6mil, minimum pad ring 7mil, minimum via ring 7mil, stop-mask expansion 3mil, vias tented up to drill 0mil, thermal gap 10mil
Holes 3.5 mm at 15,15 55,5 55,70 15,60

### Footprints (pad centres in the part's own frame; a part is rotated, then mirrored left to right if it is on the bottom)
0603-CAP = smd 1.1 x 1: 1 -0.85,0; 2 0.85,0
1210 = smd 1.2 x 2: 1 -1.6,0; 2 1.6,0
LQFP-64 = smd 1.473 x 0.229: 1 -5.626,3.75; 2 -5.626,3.25; 3 -5.626,2.75; 4 -5.626,2.25; 5 -5.626,1.75; 6 -5.626,1.25; 7 -5.626,0.75; 8 -5.626,0.25; 9 -5.626,-0.25; 10 -5.626,-0.75; 11 -5.626,-1.25; 12 -5.626,-1.75; 13 -5.626,-2.25; 14 -5.626,-2.75; 15 -5.626,-3.25; 16 -5.626,-3.75; 33 5.626,-3.75; 34 5.626,-3.25; 35 5.626,-2.75; 36 5.626,-2.25; 37 5.626,-1.75; 38 5.626,-1.25; 39 5.626,-0.75; 40 5.626,-0.25; 41 5.626,0.25; 42 5.626,0.75; 43 5.626,1.25; 44 5.626,1.75; 45 5.626,2.25; 46 5.626,2.75; 47 5.626,3.25; 48 5.626,3.75 | smd 0.229 x 1.473: 17 -3.75,-5.626; 18 -3.25,-5.626; 19 -2.75,-5.626; 20 -2.25,-5.626; 21 -1.75,-5.626; 22 -1.25,-5.626; 23 -0.75,-5.626; 24 -0.25,-5.626; 25 0.25,-5.626; 26 0.75,-5.626; 27 1.25,-5.626; 28 1.75,-5.626; 29 2.25,-5.626; 30 2.75,-5.626; 31 3.25,-5.626; 32 3.75,-5.626; 49 3.75,5.626; 50 3.25,5.626; 51 2.75,5.626; 52 2.25,5.626; 53 1.75,5.626; 54 1.25,5.626; 55 0.75,5.626; 56 0.25,5.626; 57 -0.25,5.626; 58 -0.75,5.626; 59 -1.25,5.626; 60 -1.75,5.626; 61 -2.25,5.626; 62 -2.75,5.626; 63 -3.25,5.626; 64 -3.75,5.626
SOT23-5 = smd 0.6 x 1.2: 1 -0.95,-1.306; 2 0,-1.306; 3 0.95,-1.306; 4 0.95,1.306; 5 -0.95,1.306
1X04 = drill 1.016 pad 1.88: 1 0,0; 2 2.54,0; 3 5.08,0; 4 7.62,0
MOLEX-1X2 = drill 1.016 square: 1 0,0 | drill 1.016: 2 2.54,0
1007 = smd 2 x 0.8: 1 0,1; 2 0,-1
LED-1206 = smd 1.2 x 1.4: A -1.5,0; C 1.5,0
EMITTER = drill 0.8 pad 1.5: + -1.27,-0.5; - 1.27,-0.5
DMN3150LW = smd 0.7 x 0.9: D 0,0.95; G -0.65,-0.95; S 0.65,-0.95
M0805 = smd 1.3 x 1.6: 1 -0.95,0; 2 0.95,0
0805 = smd 0.8 x 1.2: 1 -0.9,0; 2 0.9,0
0603-RES = smd 1.1 x 1: 1 -0.85,0; 2 0.85,0
RECEIVER = drill 0.8 pad 1.5: C 1.27,-0.5; E -1.27,-0.5
TACTILE_SWITCH_SMD_4.6X2.8MM = smd 0.9 x 1: 1 -2.05,-0.8; 2 2.05,-0.8; 3 2.05,0.8; 4 -2.05,0.8
SWITCH-SPDT = drill 1.016 pad 1.88: 1 0,2.54; 2 0,0; 3 0,-2.54
TESTPOINT_ROUND_2MM = smd 2 x 2: P$1 0,0
SOIC127P600X175-16N = smd 2.057 x 0.61: 1 -4.801,8.89; 2 -4.801,7.62; 3 -4.801,6.35; 4 -4.801,5.08; 5 -4.801,3.81; 6 -4.801,2.54; 7 -4.801,1.27; 8 -4.801,0; 9 0,0; 10 0,1.27; 11 0,2.54; 12 0,3.81; 13 0,5.08; 14 0,6.35; 15 0,7.62; 16 0,8.89
SOP65P640X120-17N = smd 1.57 x 0.41: 1 -2.87,2.275; 2 -2.87,1.625; 3 -2.87,0.975; 4 -2.87,0.325; 5 -2.87,-0.325; 6 -2.87,-0.975; 7 -2.87,-1.625; 8 -2.87,-2.275; 9 2.87,-2.275; 10 2.87,-1.625; 11 2.87,-0.975; 12 2.87,-0.325; 13 2.87,0.325; 14 2.87,0.975; 15 2.87,1.625; 16 2.87,2.275 | smd 2.105 x 3.115: 17 0,0
SOIC127P600X175-8N = smd 1.981 x 0.559: 1 -2.464,1.905; 2 -2.464,0.635; 3 -2.464,-0.635; 4 -2.464,-1.905; 5 2.464,-1.905; 6 2.464,-0.635; 7 2.464,0.635; 8 2.464,1.905
QFN-24-EP = smd 1.016 x 0.254: 1 -2.066,1.257; 2 -2.066,0.75; 3 -2.066,0.247; 4 -2.066,-0.287; 5 -2.066,-0.792; 6 -2.066,-1.297; 13 2.086,-1.297; 14 2.086,-0.792; 15 2.086,-0.287; 16 2.086,0.247; 17 2.086,0.75; 18 2.086,1.257 | smd 0.254 x 1.016: 7 -1.267,-2.122; 8 -0.762,-2.122; 9 -0.258,-2.122; 10 0.278,-2.122; 11 0.78,-2.122; 12 1.287,-2.122; 19 1.287,2.082; 20 0.78,2.082; 21 0.278,2.082; 22 -0.258,2.082; 23 -0.762,2.082; 24 -1.267,2.082 | smd 2.616 x 2.616: P$1 0.02,-0.01
JST_CONNECTOR_FEMALE = drill 0.889: + 0,1; - 0,-1
TPS73633(SOT-23) = smd 0.55 x 1: EN 0.95,-1.35; GND 0,-1.35; IN -0.95,-1.35; NR/FB 0.95,1.35; OUT -0.95,1.35
TPS76850(SOIC-8) = smd 0.55 x 1.5: EN(BAR) -0.635,-2.7; FB/NC -0.635,2.7; GND -1.905,-2.7; IN1 0.635,-2.7; IN2 1.905,-2.7; OUT1 0.635,2.7; OUT2 1.905,2.7; PG -1.905,2.7
MY_MM_MOTOR_MOUNT = drill 0.95 pad 2: L_CHA -20.375,26.73; L_CHB -20.375,24.19; L_GND -20.375,45.27; L_MOTOR_A -2,37.27; L_MOTOR_B -2,34.73; L_VCC -20.375,47.81; R_CHA 20.375,45.27; R_CHB 20.375,47.81; R_GND 20.375,26.73; R_MOTOR_A 2,34.73; R_MOTOR_B 2,37.27; R_VCC 20.375,24.19 | hole 2.286: 14.85,45; 14.85,27; -14.85,27; -14.85,45
SPLITTER = smd 0.102 x 0.102: 1 0,0; 2 0,0

### Placement (x,y rotation side)
C1  47.24,62.36 0 top
C2  -90.8,-222.55 0 top  (outside the outline)
C4  -90.8,-225.55 0 top  (outside the outline)
C5  50.04,59.44 0 top
C6  50.04,56.9 0 top
C7  -98.05,-248.95 0 top  (outside the outline)
C8  -90.8,-228.55 0 top  (outside the outline)
C9  -108.5,-319.05 0 top  (outside the outline)
C12  53.09,67.06 0 top
C13  50.42,63.75 0 top
C15  46.74,51.82 0 top
C16  48.13,48.9 0 top
C17  40.64,45.72 0 top
C18  40.64,43.18 0 top
C20  -98.05,-242.95 0 top  (outside the outline)
C21  -98.05,-251.95 0 top  (outside the outline)
C22  -98.05,-254.95 0 top  (outside the outline)
C23  -98.05,-257.95 0 top  (outside the outline)
C_3.3V1  -105.1,-293.1 0 top  (outside the outline)
C_3.3V2  -102.05,-293.1 0 top  (outside the outline)
C_5V1  -99,-293.1 0 top  (outside the outline)
C_5V2  -98.6,-296.2 0 top  (outside the outline)
C_BAT1  -95.95,-293.1 0 top  (outside the outline)
C_BAT2  -107.75,-299.2 0 top  (outside the outline)
C_E_H1  72.72,49.05 270 top
C_E_H2  74.75,49.05 270 top
C_ELF1  50.49,61.8 180 top
C_ELF2  56.84,58.24 180 top
C_EM_D1  76.43,37.03 270 top
C_EM_D2  78.46,37.03 270 top
C_ERF1  45.54,14.33 180 top
C_ERF2  51.89,19.15 180 top
C_GY_CP  -108.5,-316.05 0 top  (outside the outline)
C_GY_REG  -105.05,-313.05 0 top  (outside the outline)
C_GY_VDD  -108.5,-313.05 0 top  (outside the outline)
C_NR  -105.45,-296.1 0 top  (outside the outline)
CR1  57.81,45.26 0 top
IC1  -95.95,-227.25 0 top  (outside the outline)
J1  62.36,25.27 90 top
J4  -108.25,-302.95 0 top  (outside the outline)
JP1  -103.45,-256.95 0 top  (outside the outline)
JP3  -108.7,-256.95 0 top  (outside the outline)
L1  -103.25,-287.5 0 top  (outside the outline)
LED_PWR  -99.65,-287.3 0 top  (outside the outline)
LEFT_FRONT_EMITTER  59.52,70 275 top
NMOS1  54.23,60.17 0 top
NMOS2  74.04,29.62 270 top
NMOS3  53.67,10.41 180 top
NMOS4  70.92,24.23 270 top
R1  56.01,27.56 90 top
R2  46.74,57.91 0 top
R8  44.96,48.9 0 top
R9  41.91,48.9 0 top
R_ED1  75.84,33.63 0 top
R_ED2  75.84,31.57 0 top
R_ED_PD  71.65,29.41 90 top
R_EH1  73.91,24.08 0 top
R_EH2  73.91,26.11 0 top
R_EH_PD  68.48,24.03 90 top
R_ELF  54.05,63.58 0 top
R_ELF_PD  54.16,56.29 180 top
R_ERF  51.1,17.37 0 top
R_ERF_PD  53.87,13.26 0 top
R_PWR  -102.4,-296.1 0 top  (outside the outline)
R_RLD  75.41,46.51 0 top
R_RLF  57.61,63.37 90 top
R_RLH  67.87,53.72 0 top
R_RRD  77.27,28.7 0 top
R_RRF  60.94,20.8 270 top
R_RRH  71.27,20.85 270 top
R_VM1  13.72,51.82 180 top
R_VM2  13.72,54.86 180 top
R_VM4  -98,-233.95 0 top  (outside the outline)
R_VM5  -98.05,-236.95 0 top  (outside the outline)
R_VM6  -98.05,-239.95 0 top  (outside the outline)
R_VM7  -98.05,-245.95 0 top  (outside the outline)
REC_LF  62.25,64.25 273 top
S1  6.86,6.1 0 top
S2  3.81,54.1 180 top
TP1  -108.6,-322.15 0 top  (outside the outline)
TP2  -108.6,-325 0 top  (outside the outline)
TP3  -108.6,-339.25 0 top  (outside the outline)
TP4  -108.6,-342.1 0 top  (outside the outline)
TP5  -108.6,-333.55 0 top  (outside the outline)
TP6  -108.6,-336.4 0 top  (outside the outline)
U1  24.51,46.74 90 top
U2  7.62,42.42 90 top
U3  9.91,32.13 270 top
U6  -107.35,-308.05 0 top  (outside the outline)
U$1  3.81,29.97 0 top
U$2  6.1,16.76 90 top
U$3  -107.7,-288.55 0 top  (outside the outline)
U$4  -106.4,-279.55 0 top  (outside the outline)
U$7  79,47 320 top
U$8  79,27 220 top
U$9  62.25,10.38 267 top
U$11  80,40 322 top
U$12  -3.94,37.63 270 top
U$13  59.91,5.02 265 top
U$16  -109,-344.55 0 top  (outside the outline)
U$17  80,34 218 top
U$18  76,52 0 top
U$19  76,22 180 top
U$20  70,18 180 top
U$21  70,56 0 top

### Tracks (layer width: path | path; a pad name or v marks a point on that pad's centre or on a via)
3.3V  (17 unrouted)
5V  (29 unrouted)
(USART1)_RX  (1 unrouted)
(USART1)_TX  (1 unrouted)
A3.3V  (6 unrouted)
AGND  (17 unrouted)
  pour Top (no thermals): 75.72,29.31 77.09,29.21 77.09,29.31
CURRENT_SENSE  (3 unrouted)
D2_EM  (2 unrouted)
D_EM  (1 unrouted)
EM_D  (2 unrouted)
EM_H  (2 unrouted)
EM_LF  (2 unrouted)
EM_RF  (2 unrouted)
GND  (60 unrouted)
H2_EM  (2 unrouted)
H_EM  (1 unrouted)
LEFT_MOTOR_H  (2 unrouted)
LEFT_MOTOR_L  (2 unrouted)
LF_EM  (1 unrouted)
MUX_EN  (1 unrouted)
N$1  (1 unrouted)
N$5  (1 unrouted)
N$7  (1 unrouted)
N$9  (1 unrouted)
N$11  (1 unrouted)
N$12  (1 unrouted)
N$15  (1 unrouted)
N$18  (2 unrouted)
N$19  (2 unrouted)
N$20  (1 unrouted)
N$21  (2 unrouted)
N$22
  pour Top: 0,70 0,5 5,0 10,0 15,10 50,10 50,0 56,0 arc90 86,30 86,45 arc90 56,75 50,75 50,65 15,65 9.99,75 4.98,75
N$23
  pour Bottom: 0,70 0,5 5,0 10,0 15,10 50,10 50,0 56,0 arc90 86,30 86,45 arc90 56,75 50,75 50,65 15,65 9.99,75 4.98,75
N$24  (1 unrouted)
N$25  (2 unrouted)
N$26  (1 unrouted)
N$27  (1 unrouted)
N$28  (1 unrouted)
N$29  (1 unrouted)
N$31  (3 unrouted)
NRST  (3 unrouted)
PWM_MOTOR_1  (1 unrouted)
PWM_MOTOR_2  (1 unrouted)
PWM_MOTOR_3  (1 unrouted)
REC_LD  (4 unrouted)
REC_LF  (4 unrouted)
REC_LH  (4 unrouted)
REC_RD  (4 unrouted)
REC_RF  (4 unrouted)
REC_RH  (4 unrouted)
RF_EM  (1 unrouted)
RIGHT_MOTOR_H  (2 unrouted)
RIGHT_MOTOR_L  (2 unrouted)
SPI2_MISO  (1 unrouted)
SPI2_MOSI  (1 unrouted)
SPI2_NSS  (1 unrouted)
SWCLK  (1 unrouted)
V_BAT  (1 unrouted)
V_BATT  (3 unrouted)
V_BATT_POWER  (3 unrouted)
VBAT_SENSE  (2 unrouted)
VBATT  (3 unrouted)
VCC  (4 unrouted)

### Text on the board
tPlace: SN74HC15 | MUX | DRV8848 | ACS712
Document: Notes / ----------------------- / Bottom layer - GND / Add net classes / Add power planes / Use vector font